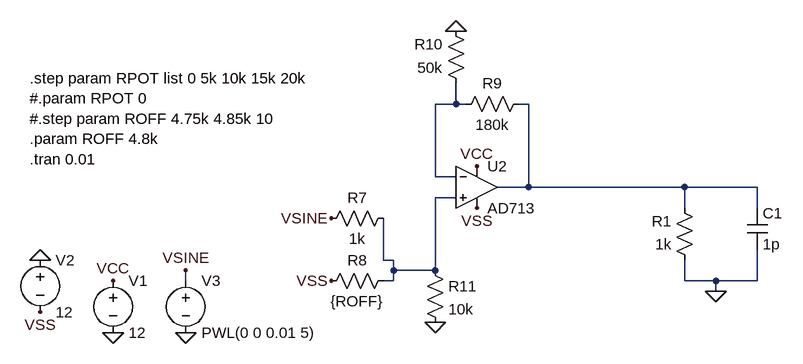
[diagram p0: schematic simple_output.asc]
simple_output.asc, the LTspice schematic file:
Version 4
SHEET 1 1016 836
WIRE -64 80 -64 48
WIRE -64 80 -96 80
WIRE -48 80 -64 80
WIRE 48 80 32 80
WIRE -96 192 -96 80
WIRE -64 192 -96 192
WIRE 48 208 48 80
WIRE 48 208 0 208
WIRE 288 208 48 208
WIRE 400 208 288 208
WIRE -64 224 -96 224
WIRE 288 240 288 208
WIRE 400 240 400 208
WIRE -176 320 -176 256
WIRE -160 320 -176 320
WIRE -160 336 -160 320
WIRE -96 336 -96 224
WIRE -96 336 -160 336
WIRE -480 352 -480 336
WIRE -160 352 -160 336
WIRE -160 352 -176 352
WIRE 288 352 288 320
WIRE 336 352 288 352
WIRE 400 352 400 304
WIRE 400 352 336 352
WIRE 336 368 336 352
FLAG -704 320 0
FLAG -592 432 0
FLAG -592 352 VCC
FLAG -704 400 VSS
FLAG -480 432 0
FLAG -480 336 VSINE
FLAG -256 256 VSINE
FLAG -256 352 VSS
FLAG -32 176 VCC
FLAG -32 240 VSS
FLAG -64 -32 0
FLAG -96 416 0
FLAG 336 368 0
SYMBOL voltage -592 336 R0
WINDOW 123 0 0 Left 0
WINDOW 39 0 0 Left 0
SYMATTR InstName V1
SYMATTR Value 12
SYMBOL voltage -704 304 R0
WINDOW 123 0 0 Left 0
WINDOW 39 0 0 Left 0
SYMATTR InstName V2
SYMATTR Value 12
SYMBOL voltage -480 336 R0
WINDOW 123 0 0 Left 0
WINDOW 39 0 0 Left 0
SYMATTR InstName V3
SYMATTR Value PWL(0 0 0.01 5)
SYMBOL res -160 240 R90
WINDOW 0 0 56 VBottom 2
WINDOW 3 32 56 VTop 2
SYMATTR InstName R7
SYMATTR Value 1k
SYMBOL res -160 336 R90
WINDOW 0 0 56 VBottom 2
WINDOW 3 32 56 VTop 2
SYMATTR InstName R8
SYMATTR Value {ROFF}
SYMBOL OpAmps\\AD713 -32 144 R0
SYMATTR InstName U2
SYMBOL res 48 64 R90
WINDOW 0 0 56 VBottom 2
WINDOW 3 32 56 VTop 2
SYMATTR InstName R9
SYMATTR Value 180k
SYMBOL res -48 64 R180
WINDOW 0 36 76 Left 2
WINDOW 3 36 40 Left 2
SYMATTR InstName R10
SYMATTR Value 50k
SYMBOL res -112 320 R0
SYMATTR InstName R11
SYMATTR Value 10k
SYMBOL res 304 336 R180
WINDOW 0 36 76 Left 2
WINDOW 3 36 40 Left 2
SYMATTR InstName R1
SYMATTR Value 1k
SYMBOL cap 384 240 R0
SYMATTR InstName C1
SYMATTR Value 1p
TEXT -720 40 Left 2 !.step param RPOT list 0 5k 10k 15k 20k\n#.param RPOT 0\n#.step param ROFF 4.75k 4.85k 10\n.param ROFF 4.8k\n.tran 0.01

The netlist it stands for:
* simple_output.asc
V1 VCC 0 12
V2 0 VSS 12
V3 VSINE 0 PWL(0 0 0.01 5)
R7 N003 VSINE 1k
R8 N003 VSS {ROFF}
XU2 N003 N001 VCC VSS N002 AD712  ; AD713, pins In+ In- V+ V- OUT
R9 N002 N001 180k
R10 N001 0 50k
R11 N003 0 10k
R1 0 N002 1k
C1 N002 0 1p
.step param RPOT list 0 5k 10k 15k 20k
#.param RPOT 0
#.step param ROFF 4.75k 4.85k 10
.param ROFF 4.8k
.tran 0.01
.lib ADI1.lib
.backanno
.end